# EAGLE design AdaptI2C-RF (EAGLE 7.2.0)
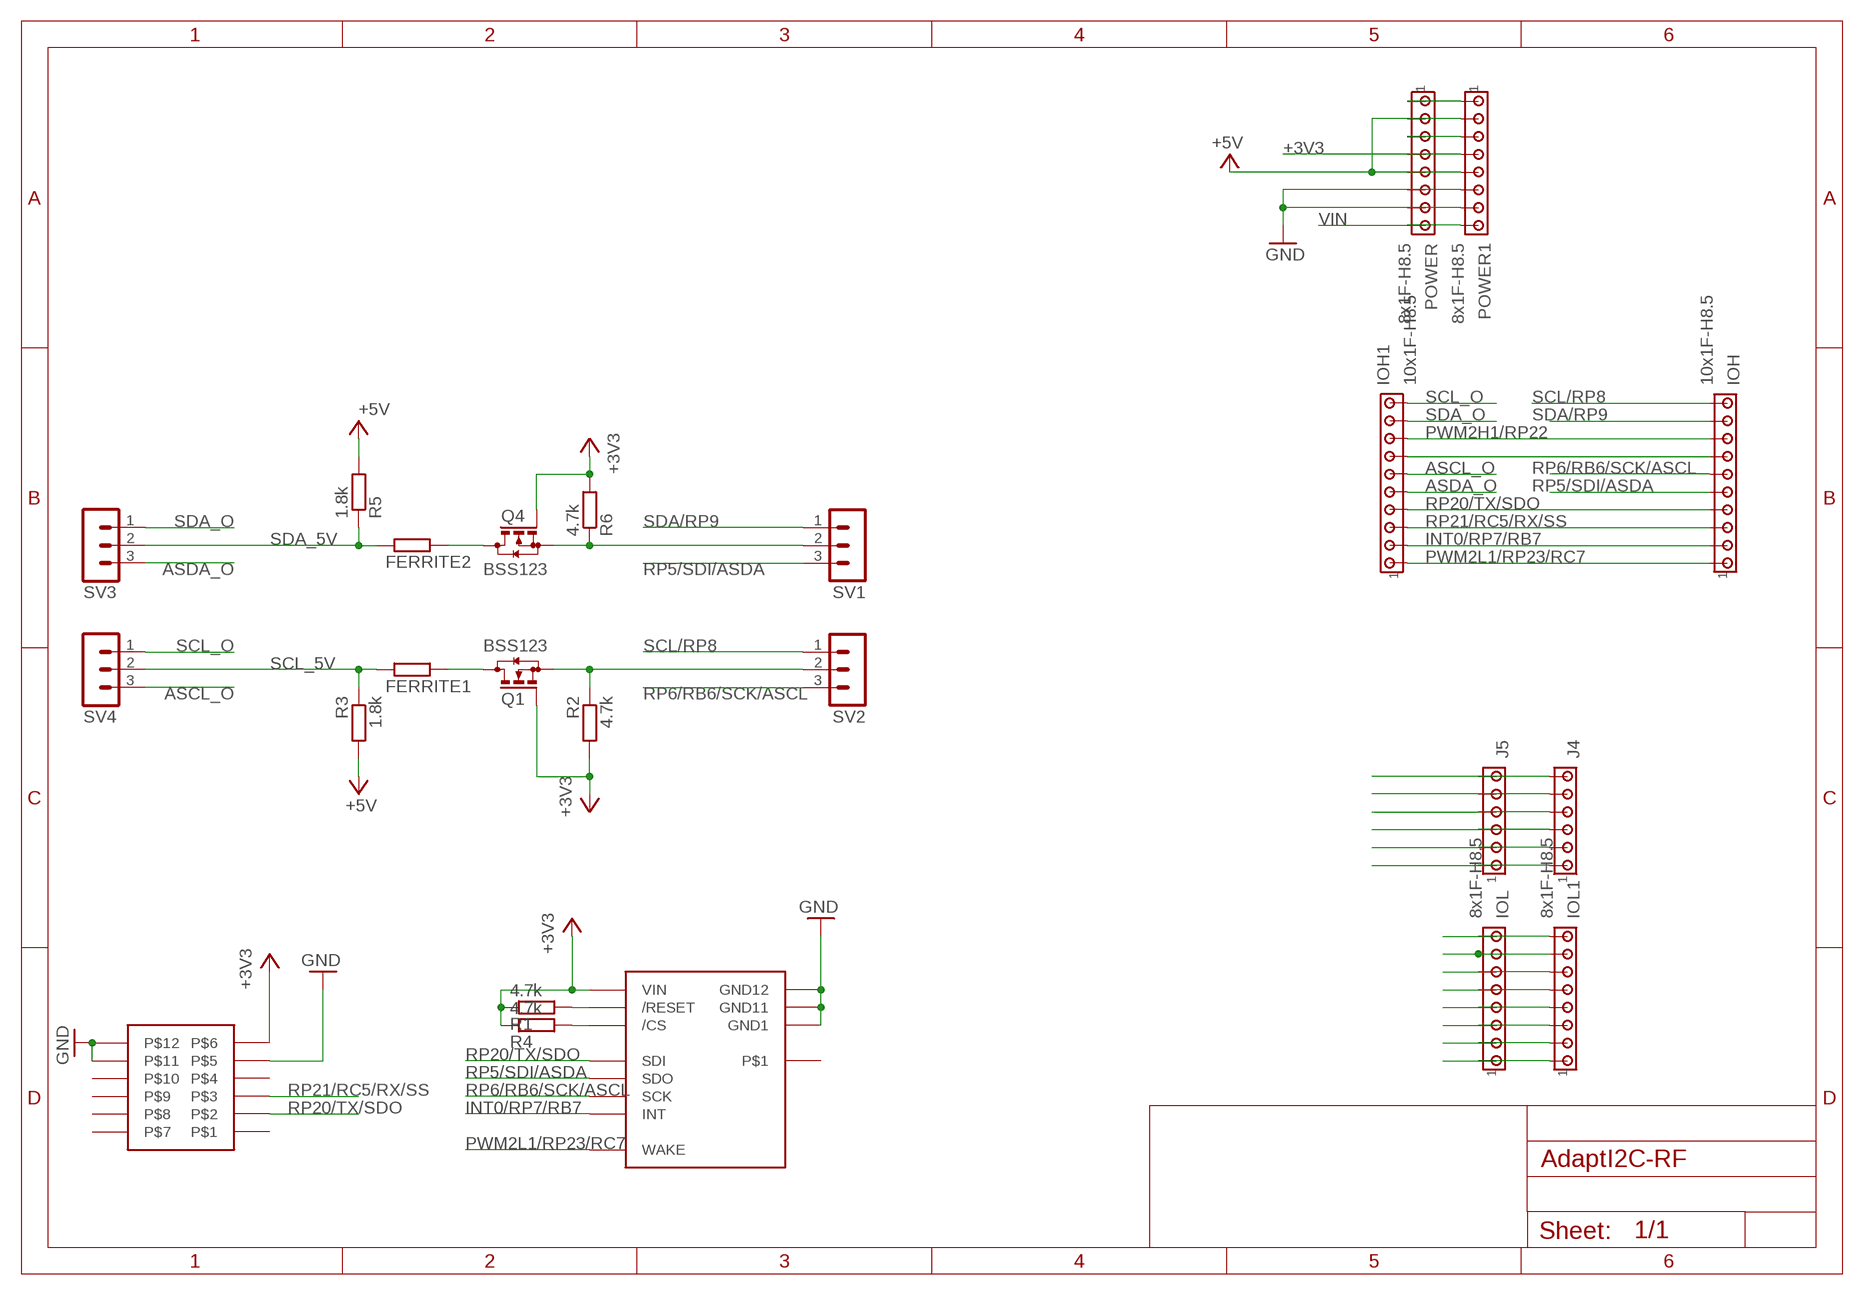
[diagram p0: schematic, sheet 1]

## Parts
FERRITE1  R-EU_M0805  [M0805]
FERRITE2  R-EU_M0805  [M0805]
IOH  10x1F-H8.5  MTA10-100  [10X10MTA]
IOH1  10x1F-H8.5  MTA10-100  [10X10MTA]
IOL  8x1F-H8.5  MTA08-100  [10X08MTA]
IOL1  8x1F-H8.5  MTA08-100  [10X08MTA]
J4  MTA06-100  [10X06MTA]
J5  MTA06-100  [10X06MTA]
POWER  8x1F-H8.5  MTA08-100  [10X08MTA]
POWER1  8x1F-H8.5  MTA08-100  [10X08MTA]
Q1  BSS123  [SOT23]
Q4  BSS123  [SOT23]
R1  4.7k  R-EU_R0805  [R0805]
R2  4.7k  R-EU_R0805  [R0805]
R3  1.8k  R-EU_0204/7  [0204/7]
R4  4.7k  R-EU_R0805  [R0805]
R5  1.8k  R-EU_0204/7  [0204/7]
R6  4.7k  R-EU_R0805  [R0805]
SV1  MA03-1  [MA03-1]
SV2  MA03-1  [MA03-1]
SV3  MA03-1  [MA03-1]
SV4  MA03-1  [MA03-1]
U$2  MRF24J40MA  [MRF24J40MA]
U$7  PMOD2X6  [PMOD2X6]

## Nets
+3V3: POWER1.4 POWER.4 Q1.1(G) Q4.1(G) R1.1 R2.2 R4.1 R6.2 U$2.P$10(VIN) U$7.P$6
+5V: POWER1.2 POWER1.5 POWER.2 POWER.5 R3.2 R5.2
AN0/RA0: J4.1 J5.1
AN1/RA1: J4.2 J5.2
ASCL: FERRITE1.2 Q1.3(D)
ASCL_O: IOH1.6 SV4.3
ASDA: FERRITE2.2 Q4.3(D)
ASDA_O: IOH1.5 SV3.3
GND: POWER1.6 POWER1.7 POWER.6 POWER.7 U$2.P$1(GND1) U$2.P$11(GND11) U$2.P$12(GND12) U$7.P$5 U$7.P$11 U$7.P$12
INT0/RP7/RB7: IOH1.2 IOH.2 U$2.P$4(INT)
N$1: POWER1.1 POWER.1
N$2: POWER1.3 POWER.3
N$3: IOH1.7 IOH.7
N$5: R1.2 U$2.P$2(/RESET)
N$7: Q1.2(S) R2.1 SV2.2
N$8: Q4.2(S) R6.1 SV1.2
PWM1H1/RP14/RB14: IOL1.2 IOL.2
PWM1H2/RP12/RB12: IOL1.4 IOL.4
PWM1H3/RP10/RB10: IOL1.6 IOL.6
PWM1L1/RP15/RB15: IOL1.1 IOL.1
PWM1L2/RP13/RB13: IOL1.3 IOL.3
PWM1L3/RP11/RB11: IOL1.5 IOL.5
PWM2H1/RP22: IOH1.8 IOH.8
PWM2L1/RP23/RC7: IOH1.1 IOH.1 U$2.P$3(WAKE)
RP2/RB2/AN4: J4.3 J5.3
RP3/RB3/AN5: J4.4 J5.4
RP5/SDI/ASDA: IOH.5 SV1.3 U$2.P$7(SDO)
RP6/RB6/SCK/ASCL: IOH.6 SV2.3 U$2.P$6(SCK)
RP16/RC0/AN6: J4.5 J5.5
RP17/RC1/AN7: J4.6 J5.6
RP20/TX/SDO: IOH1.4 IOH.4 U$2.P$5(SDI) U$7.P$2
RP21/RC5/RX/SS: IOH1.3 IOH.3 R4.2 U$2.P$8(/CS) U$7.P$3
RP24/RC8: IOL1.8 IOL.8
RP25/RC9: IOL1.7 IOL.7
SCL/RP8: IOH.10 SV2.1
SCL_5V: FERRITE1.1 R3.1 SV4.2
SCL_O: IOH1.10 SV4.1
SDA/RP9: IOH.9 SV1.1
SDA_5V: FERRITE2.1 R5.1 SV3.2
SDA_O: IOH1.9 SV3.1
VIN: POWER1.8 POWER.8
Unconnected: U$2.P$9 U$7.P$1 U$7.P$4 U$7.P$7 U$7.P$8 U$7.P$9 U$7.P$10

## Library data of the parts
FERRITE1 FERRITE2 = LibPerso:R-EU_: RESISTOR, European symbol; OC_FARNELL: 2292459
IOH IOH1 = LibPerso:MTA10-100: AMP connector; OC_FARNELL: 1593464
IOL IOL1 POWER POWER1 = LibPerso:MTA08-100: AMP connector; OC_FARNELL: 1593463
J4 J5 = LibPerso:MTA06-100: AMP connector; OC_FARNELL: 1593462
Q1 Q4 = transistor-small-signal:BSS123: N-CHANNEL MOS FET
R1-R6 = rcl:R-EU_: RESISTOR, European symbol
SV1-SV4 = LibPerso:MA03-1: PIN HEADER
U$2 = LibPerso:MRF24J40MA
U$7 = LibPerso:PMOD2X6

## Net classes
0 default: width 0.254 mm, clearance 0.254 mm
1 power: width 0.61 mm, drill 0.61 mm, clearance 0.254 mm
2 gnd: width 0.305 mm, drill 0.559 mm, clearance 0.254 mm
3 usbvcc: width 0.508 mm, drill 0.61 mm, clearance 0.254 mm
4 aref: width 0.406 mm, drill 0.61 mm, clearance 0.254 mm

## Board
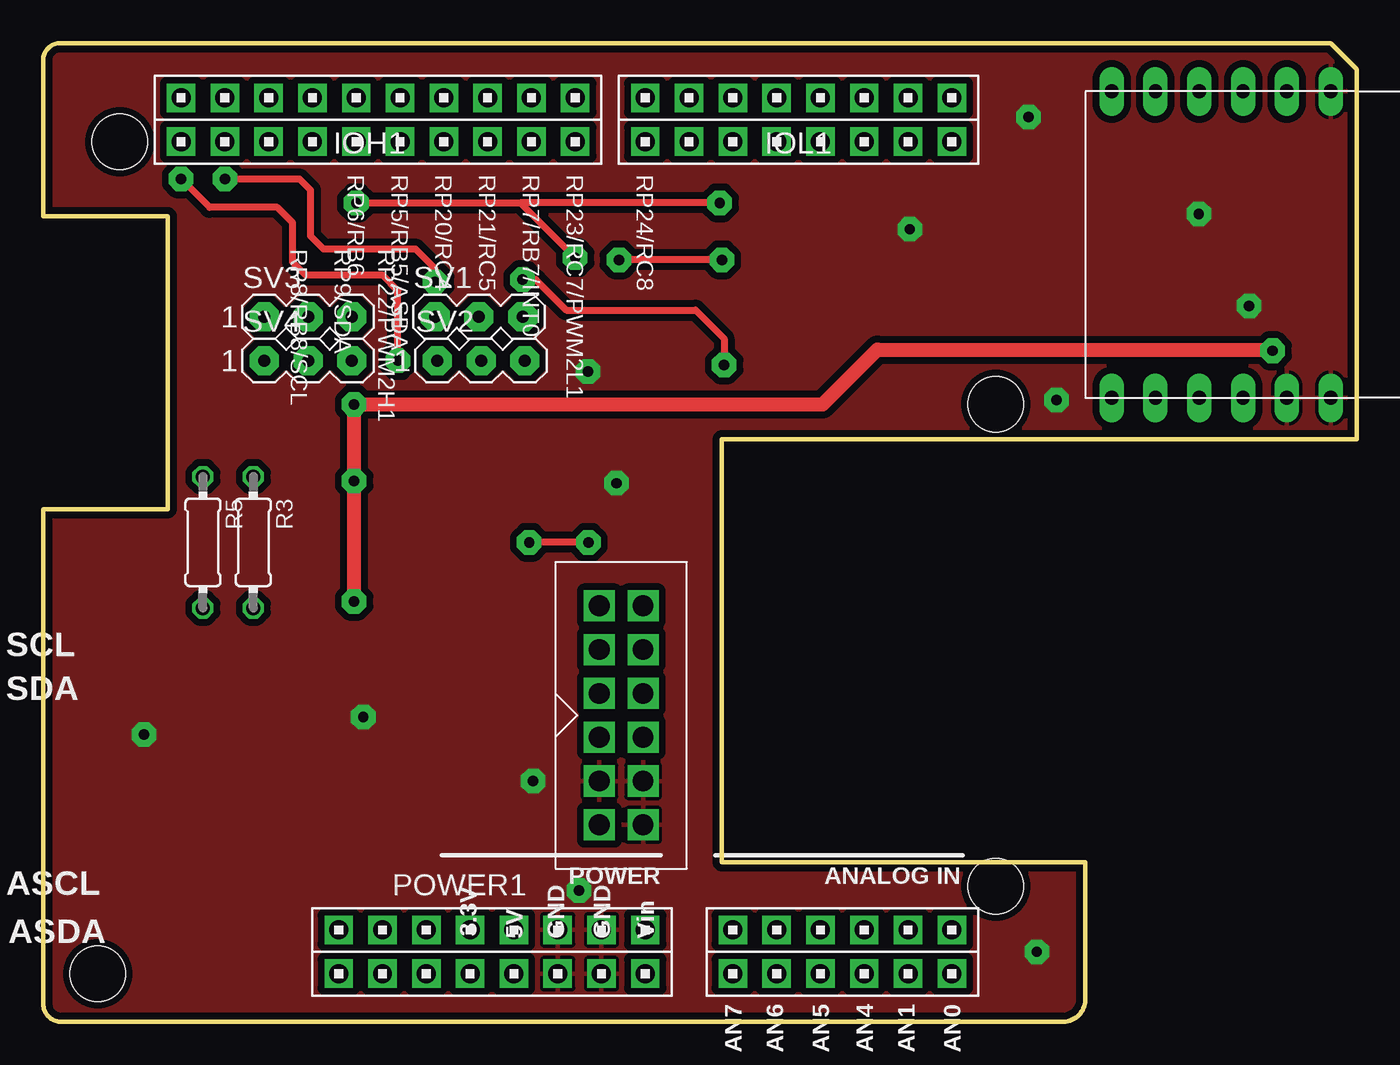
[diagram p1: board, top side]
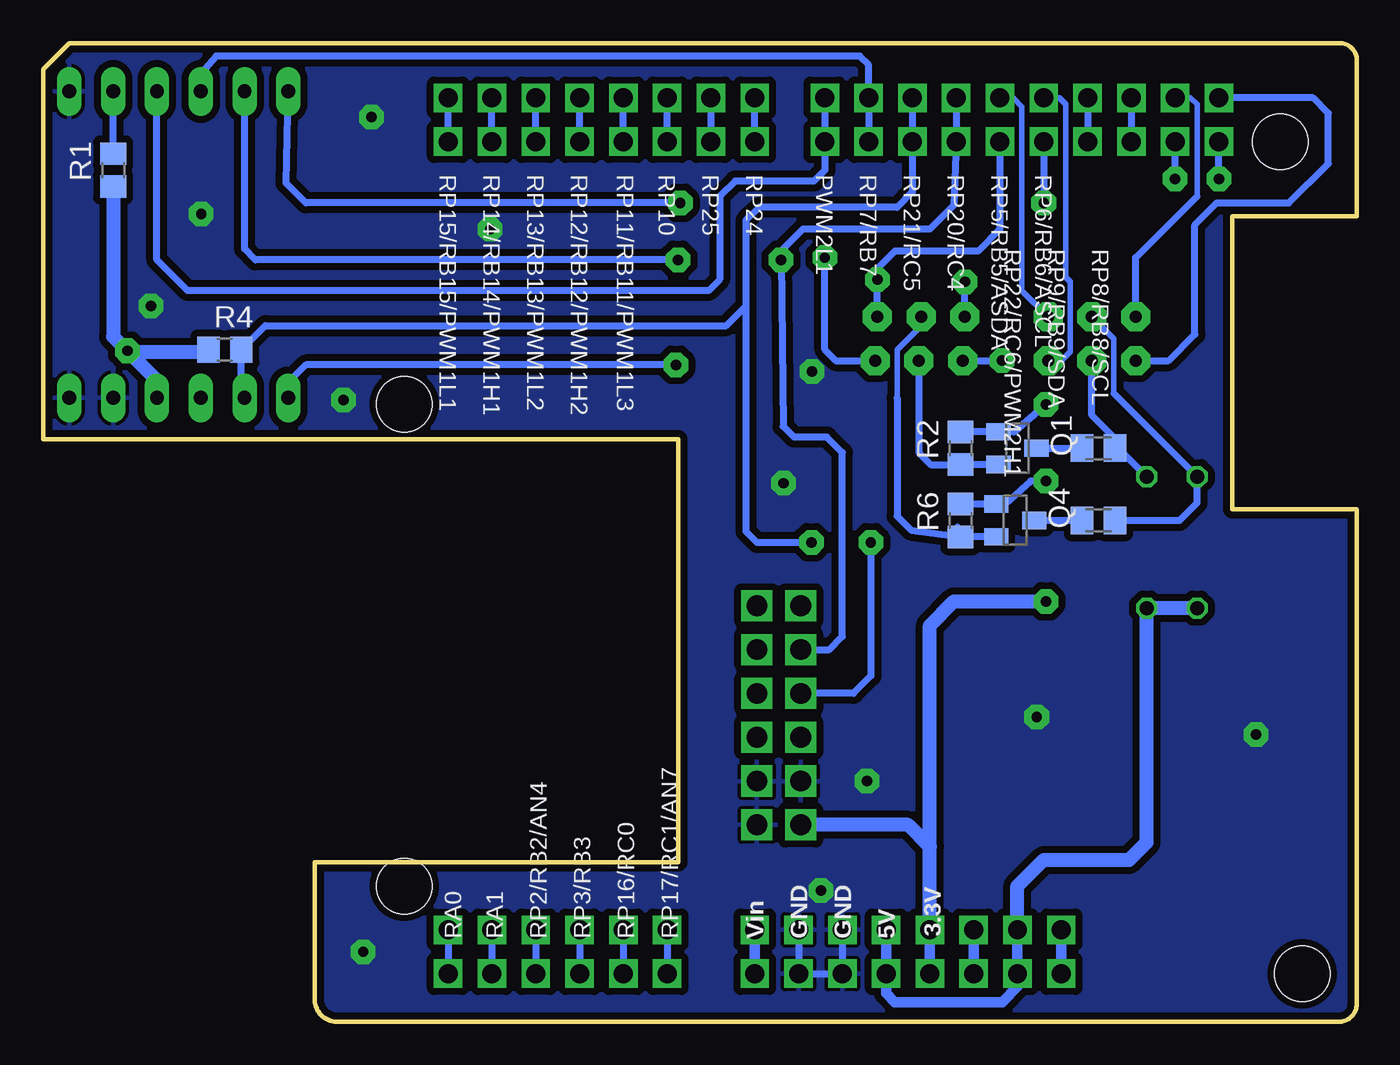
[diagram p2: board, bottom side, seen from below]

Size 76.2 x 56.77 mm. Coordinates in mm from the lower left corner, seen from the top.
Outline: 74.68,56.77 76.2,55.24 76.2,33.78 39.37,33.78 39.37,9.27 60.45,9.27 60.45,1.38 arc-90 59.2,0 1,0 arc-90 0,1.13 0,29.72 7.24,29.72 7.24,46.74 0,46.74 0,55.77 arc-90 1,56.77 74.68,56.77
Copper layers (1*16): Top 0.018mm / dielectric 1.55mm / Bottom 0.018mm
Design rules "eC_2Layer_PClass6_BaseCopperO18_eCDefault": minimum track width 0.15mm, minimum drill 0.35mm, track to track 0.15mm, track to pad 0.15mm, pad to pad 0.15mm, via to via 0.15mm, smd to smd 0mil, copper to edge 0.25mm, drill to drill 0.35mm, minimum pad ring 0.175mm, minimum via ring 0.125mm, stop-mask expansion 0mil, vias tented up to drill 0.45mm, thermal gap 0.2mm
Holes 3.2 mm at 55.25,35.81 55.25,7.87 4.45,51.05 3.18,2.79

### Footprints (pad centres in the part's own frame; a part is rotated, then mirrored left to right if it is on the bottom)
M0805 = smd 1.3 x 1.6: 1 -0.95,0; 2 0.95,0
10X10MTA = drill 1.1 square: 1 11.43,0; 2 8.89,0; 3 6.35,0; 4 3.81,0; 5 1.27,0; 6 -1.27,0; 7 -3.81,0; 8 -6.35,0; 9 -8.89,0; 10 -11.43,0
10X08MTA = drill 1.1 square: 1 8.89,0; 2 6.35,0; 3 3.81,0; 4 1.27,0; 5 -1.27,0; 6 -3.81,0; 7 -6.35,0; 8 -8.89,0
10X06MTA = drill 1.1 square: 1 6.35,0; 2 3.81,0; 3 1.27,0; 4 -1.27,0; 5 -3.81,0; 6 -6.35,0
SOT23 = smd 1 x 1.4: 1 -0.95,-1.1; 2 0.95,-1.1; 3 0,1.1
R0805 = smd 1.3 x 1.5: 1 -0.95,0; 2 0.95,0
0204/7 = drill 0.813 octagon: 1 -3.81,0; 2 3.81,0
MA03-1 = drill 0.7 pad 1.676 octagon: 1 -2.54,0; 2 0,0; 3 2.54,0
MRF24J40MA = drill 0.8 pad 1.422 long: P$1 0,0; P$2 0,-2.54; P$3 0,-5.08; P$4 0,-7.62; P$5 0,-10.16; P$6 0,-12.7; P$7 17.78,-12.7; P$8 17.78,-10.16; P$9 17.78,-7.62; P$10 17.78,-5.08; P$11 17.78,-2.54; P$12 17.78,0
PMOD2X6 = drill 1.2 pad 1.778 square: P$1 0,0; P$2 2.54,0; P$3 5.08,0; P$4 7.62,0; P$5 10.16,0; P$6 12.7,0; P$7 0,2.54; P$8 2.54,2.54; P$9 5.08,2.54; P$10 7.62,2.54; P$11 10.16,2.54; P$12 12.7,2.54

### Placement (x,y rotation side)
FERRITE1  14.99,33.27 180 bottom
FERRITE2  14.99,29.08 180 bottom
IOH  19.43,51.05 0 top
IOH1  19.43,53.59 0 top
IOL  43.82,51.05 0 top
IOL1  43.82,53.59 0 top
J4  46.36,5.33 0 top
J5  46.36,2.79 0 top
POWER  26.04,2.79 180 top
POWER1  26.04,5.33 180 top
Q1  19.69,33.27 270 bottom
Q4  19.81,29.08 270 bottom
R1  72.14,49.4 90 bottom
R2  22.99,33.27 90 bottom
R3  12.19,27.81 270 top
R4  65.66,38.99 0 bottom
R5  9.27,27.81 270 top
R6  22.99,29.08 90 bottom
SV1  25.27,40.89 0 top
SV2  25.4,38.35 0 top
SV3  15.37,40.89 0 top
SV4  15.37,38.35 0 top
U$2  74.68,53.98 270 top
U$7  32.26,24.13 270 top

### Tracks (layer width: path | path; a pad name or v marks a point on that pad's centre or on a via)
+3V3  (via drill 0.6 pad 1.42)
  Top 0.813: v71.31,38.93 71.25,38.99 48.39,38.99 45.21,35.81 v18.04,35.81 v18.04,31.37 v18.04,24.38
  Bottom 0.406: R2.2 Q1.1 19.88,34.22 v18.04,35.81 | R6.2 Q4.1 20.39,30.03 18.92,31.37 v18.04,31.37
  Bottom 0.61: POWER1.4 POWER.4
  Bottom 0.813: U$7.P$6 26.04,11.43 24.77,10.16 | POWER1.4 24.77,10.16 | 24.77,10.16 24.77,22.99 23.37,24.38 v18.04,24.38 | R1.1 72.14,39.75 v71.31,38.93 71.25,38.86 | 71.25,38.86 66.74,38.86 R4.1 | U$2.P$10 69.6,37.21 71.25,38.86
+5V
  Bottom 0.61: POWER1.2 POWER.2 19.69,2.03 20.58,1.14 26.8,1.14 27.31,1.65 POWER.5 POWER1.5
  Bottom 0.813: R5.2 R3.2 12.19,10.41 13.21,9.4 18.16,9.4 19.69,7.87 POWER1.2
AN0/RA0
  Bottom 0.406: J4.1 J5.1
AN1/RA1
  Bottom 0.406: J4.2 J5.2
ASCL
  Bottom 0.406: Q1.3 FERRITE1.2
ASCL_O
  Bottom 0.305: IOH1.6 17.27,53.59 16.89,53.21 16.89,43.18 16.64,42.93 16.64,38.86 17.15,38.35 SV4.3
ASDA
  Bottom 0.406: Q4.3 FERRITE2.2
ASDA_O
  Bottom 0.305: SV3.3 19.43,42.42 19.43,53.09 19.94,53.59 IOH1.5
GND  (via drill 0.6 pad 1.42)
  Bottom 0.406: POWER1.7 POWER.7 POWER.6 POWER1.6
  other vias: 50.27,45.97 18.57,17.68 5.84,16.66 57.63,4.06 31.09,7.62 57.15,52.48 28.42,13.97 33.25,31.24 67.03,46.86 31.6,37.72 58.78,36.07 69.95,41.53
  pour Bottom (isolate 0.406, rank 2): 0,56.52 74.68,56.52 76.2,54.99 76.2,0.13 0,0
  pour Top (isolate 0.406, rank 2): 0,56.39 76.2,56.52 76.2,0.13 0,0
INT0/RP7/RB7
  Bottom 0.406: IOH.2 IOH1.2 28.32,55.5 28.83,56.01 66.17,56.01 67.06,54.99 U$2.P$4
N$1
  Bottom 0.61: POWER1.1 POWER.1
N$2
  Bottom 0.61: POWER1.3 POWER.3
N$3
  Bottom 0.406: IOH1.7 IOH.7
N$5
  Bottom 0.406: R1.2 U$2.P$2
N$7
  Bottom 0.406: Q1.2 R2.1 24.71,32.32 25.4,33.02 SV2.2
N$8
  Bottom 0.305: 26.67,36.2 26.67,38.99 25.27,40.39 SV1.2
  Bottom 0.406: R6.1 23.56,28.51 | Q4.2 R6.1 | 23.18,28.7 R6.1 | 26.67,36.2 26.67,29.34 25.85,28.51 R6.1
PWM1H1/RP14/RB14
  Bottom 0.406: IOL.2 IOL1.2
PWM1H2/RP12/RB12
  Bottom 0.406: IOL.4 IOL1.4
PWM1H3/RP10/RB10
  Bottom 0.406: IOL.6 IOL1.6
PWM1L1/RP15/RB15
  Bottom 0.406: IOL.1 IOL1.1
PWM1L2/RP13/RB13
  Bottom 0.406: IOL.3 IOL1.3
PWM1L3/RP11/RB11
  Bottom 0.406: IOL.5 IOL1.5
PWM2H1/RP22
  Bottom 0.406: IOH1.8 IOH.8
PWM2L1/RP23/RC7
  Bottom 0.406: IOH1.1 IOH.1 30.86,49.4 31.5,48.77 36.07,48.77 36.96,47.88 36.96,43.05 37.59,42.42 67.82,42.42 69.6,44.2 U$2.P$3
RP2/RB2/AN4
  Bottom 0.406: J4.3 J5.3
RP3/RB3/AN5
  Bottom 0.406: J4.4 J5.4
RP5/SDI/ASDA  (via drill 0.6 pad 1.42)
  Top 0.406: v27.81,43.05 28.58,43.05 30.35,41.27 37.85,41.27 39.5,39.62 v39.5,38.1
  Bottom 0.406: IOH.5 20.7,45.97 21.97,44.7 26.8,44.7 27.81,43.69 v27.81,43.05 SV1.3 | v39.5,38.1 60.96,38.1 61.98,37.08 U$2.P$7
RP6/RB6/SCK/ASCL  (via drill 0.6 pad 1.42)
  Top 0.406: v18.16,47.5 27.69,47.5 | 27.69,47.5 v30.86,44.32 | v39.24,47.5 27.69,47.5
  Bottom 0.406: IOH.6 v18.16,47.5 | SV2.3 30.23,38.35 30.86,38.99 v30.86,44.32 | v39.24,47.5 60.96,47.5 62.1,48.64 U$2.P$6
RP16/RC0/AN6
  Bottom 0.406: J4.5 J5.5
RP17/RC1/AN7
  Bottom 0.406: J4.6 J5.6
RP20/TX/SDO  (via drill 0.6 pad 1.42)
  Top 0.406: v39.37,44.2 v33.4,44.2
  Bottom 0.406: IOH1.4 IOH.4 23.37,47.37 24.77,45.97 32.13,45.97 33.28,44.83 v33.4,44.2 33.28,34.54 32.64,33.91 30.74,33.91 29.85,33.02 29.85,22.35 30.61,21.59 U$7.P$2 | v39.37,44.2 63.88,44.2 64.52,44.83 U$2.P$5
RP21/RC5/RX/SS  (via drill 0.6 pad 1.42)
  Top 0.406: v31.62,27.81 v28.2,27.81
  Bottom 0.406: IOH1.3 IOH.3 25.78,48.13 26.67,47.24 34.67,47.24 35.43,46.48 35.43,41.4 | 35.43,41.4 35.43,28.45 34.8,27.81 v31.62,27.81 | v28.2,27.81 28.2,20.07 29.21,19.05 U$7.P$3 | 35.43,41.4 35.56,41.4 36.58,40.39 63.31,40.39 R4.2 64.71,35.81 U$2.P$8
RP24/RC8
  Bottom 0.406: IOL.8 IOL1.8
RP25/RC9
  Bottom 0.406: IOL1.7 IOL.7 37.85,50.67
SCL/RP8  (via drill 0.6 pad 1.42)
  Top 0.406: v20.58,38.35 20.58,42.42 19.69,43.31 15.24,43.31 14.48,44.07 14.48,46.35 13.59,47.24 9.65,47.24 v8,48.89
  Bottom 0.406: SV2.1 v20.58,38.35 | v8,48.89 IOH.10
SCL_5V
  Bottom 0.406: FERRITE1.1 14.04,33.47 | SV4.2 15.37,35.18 14.04,33.85 14.04,33.47 | R3.1 14.04,33.47
SCL_O
  Bottom 0.406: SV4.1 10.92,38.35 9.4,39.88 9.4,46.23 8.13,47.5 3.94,47.5 1.65,49.78 1.65,52.7 2.54,53.59 IOH1.10
SDA/RP9  (via drill 0.6 pad 1.42)
  Top 0.406: v22.73,42.93 22.73,43.69 21.59,44.83 16.26,44.83 15.5,45.59 15.5,48.26 14.86,48.89 v10.54,48.89
  Bottom 0.406: SV1.1 v22.73,42.93 | v10.54,48.89 IOH.9
SDA_5V
  Bottom 0.305: 14.1,36.45 14.1,39.62 SV3.2
  Bottom 0.406: FERRITE2.1 10.29,29.08 9.27,30.1 R5.1 14.1,36.45
SDA_O
  Bottom 0.305: IOH1.9 9.65,53.59 9.27,53.21 9.27,47.88
  Bottom 0.406: SV3.1 12.83,44.32 9.27,47.88
VIN
  Bottom 0.61: POWER1.8 POWER.8

### Text on the board
tNames: RP6/RB6 | RP5/RB5/ASDA | RP20/RC4 | RP21/RC5 | RP7/RB7/INT0 | RP23/RC7/PWM2L1 | RP24/RC8 | RP8/RB8/SCL | RP9/SDA | RP22/PWM2H1 | SCL | SDA | POWER | ANALOG IN | ASCL | ASDA | 3.3V | 5V | GND | GND | Vin | AN7 | AN6 | AN5 | AN4 | AN1 | AN0
bNames: RP6/RB6/ASCL | RP5/RB5/ASDA | RP20/RC4 | RP21/RC5 | RP7/RB7 | PWM2L1 | RP24 | RP25 | RP10 | RP11/RB11/PWM1L3 | RP12/RB12/PWM1H2 | RP13/RB13/PWM1L2 | RP14/RB14/PWM1H1 | RP15/RB15/PWM1L1 | RP8/RB8/SCL | RP9/RB9/SDA | RP22/RC6/PWM2H1 | 3.3V | 5V | GND | GND | Vin | RP17/RC1/AN7 | RP16/RC0 | RP3/RB3 | RP2/RB2/AN4 | RA1 | RA0
214bmp: D:/SmartProjects/Snc/a4_bn_logo2.bmp